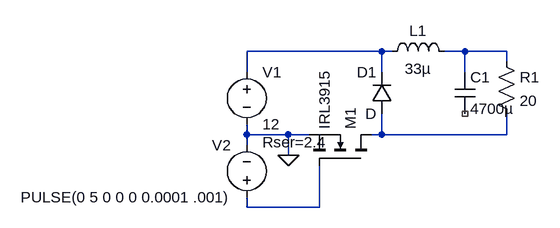
[diagram p0: schematic proto_buck.asc]
proto_buck.asc, the LTspice schematic file:
Version 4
SHEET 1 880 680
WIRE 224 80 16 80
WIRE 240 80 224 80
WIRE 352 80 320 80
WIRE 416 80 352 80
WIRE 416 96 416 80
WIRE 16 112 16 80
WIRE 224 112 224 80
WIRE 352 112 352 80
WIRE 16 208 16 192
WIRE 80 208 16 208
WIRE 112 208 80 208
WIRE 224 208 224 176
WIRE 224 208 208 208
WIRE 416 208 416 176
WIRE 416 208 224 208
WIRE 16 224 16 208
WIRE 80 240 80 208
WIRE 16 320 16 304
WIRE 128 320 128 256
WIRE 128 320 16 320
FLAG 80 240 0
SYMBOL voltage 16 96 R0
WINDOW 123 0 0 Left 0
WINDOW 39 24 124 Left 2
SYMATTR SpiceLine Rser=2.4
SYMATTR InstName V1
SYMATTR Value 12
SYMBOL cap 336 112 R0
SYMATTR InstName C1
SYMATTR Value 4700µ
SYMBOL nmos 208 256 M270
SYMATTR InstName M1
SYMATTR Value IRL3915
SYMBOL voltage 16 320 R180
WINDOW 0 24 96 Left 2
WINDOW 3 24 16 Left 2
WINDOW 123 0 0 Left 0
WINDOW 39 0 0 Left 0
SYMATTR InstName V2
SYMATTR Value PULSE(0 5 0 0 0 0.0001 .001)
SYMBOL res 400 80 R0
SYMATTR InstName R1
SYMATTR Value 20
SYMBOL ind 224 96 R270
WINDOW 0 32 56 VTop 2
WINDOW 3 5 56 VBottom 2
SYMATTR InstName L1
SYMATTR Value 33µ
SYMBOL diode 240 176 R180
WINDOW 0 24 64 Left 2
WINDOW 3 24 0 Left 2
SYMATTR InstName D1

The netlist it stands for:
* proto_buck.asc
V1 N001 0 12 Rser=2.4
C1 N002 NC_01 4700µ
M1 N003 N004 0 0 IRL3915
V2 N004 0 PULSE(0 5 0 0 0 0.0001 .001)
R1 N002 N003 20
L1 N001 N002 33µ
D1 N003 N001 D
.model D D
.lib standard.dio
.model NMOS NMOS
.model PMOS PMOS
.lib standard.mos
.backanno
.end